# Altium schematic sheet main.SchDoc: Main
size Letter; SheetNumber: 2; SheetTotal: 2
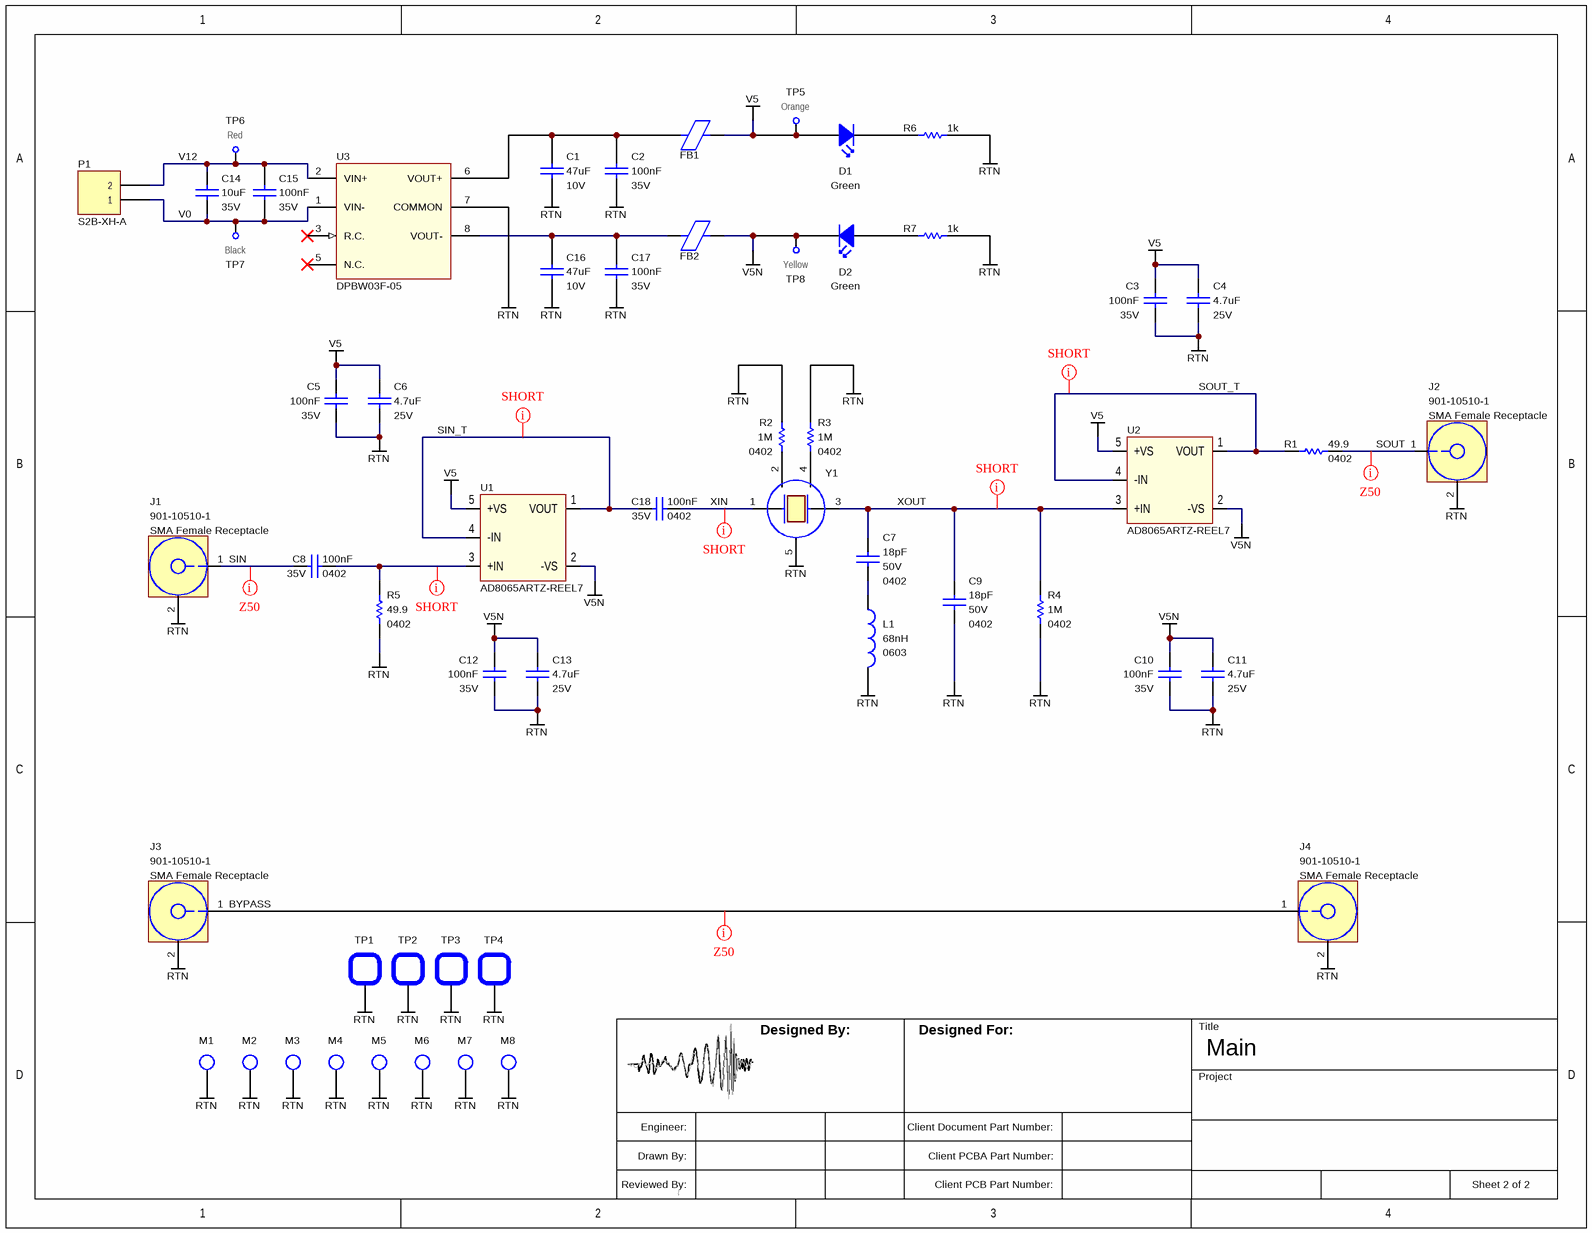
[diagram p0: main.SchDoc]

## Parts
C1  value 47uF  Voltage: 10V  [CAPC3225X25N]  (hidden comment: CGA6P1X7S1A476M250AC)
C2  value 100nF  Voltage: 35V  [CAPC1005X05N]  (hidden comment: CGA2B3X7R1V104K050BB)
C3  value 100nF  Voltage: 35V  [CAPC1005X05N]  (hidden comment: CGA2B3X7R1V104K050BB)
C4  value 4.7uF  Voltage: 25V  [CAPC2012X125N]  (hidden comment: CGA4J3X5R1E475K125AB)
C5  value 100nF  Voltage: 35V  [CAPC1005X05N]  (hidden comment: CGA2B3X7R1V104K050BB)
C6  value 4.7uF  Voltage: 25V  [CAPC2012X125N]  (hidden comment: CGA4J3X5R1E475K125AB)
C7  value 18pF  Voltage: 50V  Package: 0402  [CAPC1005X05N]  (hidden comment: CGA2B2C0G1H180J050BA)
C8  value 100nF  Voltage: 35V  Package: 0402  [CAPC1005X05N]  (hidden comment: CGA2B3X7R1V104K050BB)
C9  value 18pF  Voltage: 50V  Package: 0402  [CAPC1005X05N]  (hidden comment: CGA2B2C0G1H180J050BA)
C10  value 100nF  Voltage: 35V  [CAPC1005X05N]  (hidden comment: CGA2B3X7R1V104K050BB)
C11  value 4.7uF  Voltage: 25V  [CAPC2012X125N]  (hidden comment: CGA4J3X5R1E475K125AB)
C12  value 100nF  Voltage: 35V  [CAPC1005X05N]  (hidden comment: CGA2B3X7R1V104K050BB)
C13  value 4.7uF  Voltage: 25V  [CAPC2012X125N]  (hidden comment: CGA4J3X5R1E475K125AB)
C14  value 10uF  Voltage: 35V  [CAPC3216X16N]  (hidden comment: CGA5L3X5R1V106M160AB)
C15  value 100nF  Voltage: 35V  [CAPC1005X05N]  (hidden comment: CGA2B3X7R1V104K050BB)
C16  value 47uF  Voltage: 10V  [CAPC3225X25N]  (hidden comment: CGA6P1X7S1A476M250AC)
C17  value 100nF  Voltage: 35V  [CAPC1005X05N]  (hidden comment: CGA2B3X7R1V104K050BB)
C18  value 100nF  Voltage: 35V  Package: 0402  [CAPC1005X05N]  (hidden comment: CGA2B3X7R1V104K050BB)
D1  Color: Green  [0603_LED]  (hidden comment: LTST-C191KGKT)
D2  Color: Green  [0603_LED]  (hidden comment: LTST-C191KGKT)
FB1  BLM18AG102SN1  [INDC1608X08N]  (value not drawn)
FB2  BLM18AG102SN1  [INDC1608X08N]  (value not drawn)
J1  Notes: SMA Female Receptacle  [901-10510-1]
J2  Notes: SMA Female Receptacle  [901-10510-1]
J3  Notes: SMA Female Receptacle  [901-10510-1]
J4  Notes: SMA Female Receptacle  [901-10510-1]
L1  value 68nH  Package: 0603  [INDC1608X08N]  (hidden comment: LQW18AN68NJ00D)
M1  MOUNTM3  [MOUNTM3]  (value not drawn)  (no BOM)
M2  MOUNTM3  [MOUNTM3]  (value not drawn)  (no BOM)
M3  MOUNTM3  [MOUNTM3]  (value not drawn)  (no BOM)
M4  MOUNTM3  [MOUNTM3]  (value not drawn)  (no BOM)
M5  MOUNTM3  [MOUNTM3]  (value not drawn)  (no BOM)
M6  MOUNTM3  [MOUNTM3]  (value not drawn)  (no BOM)
M7  MOUNTM3  [MOUNTM3]  (value not drawn)  (no BOM)
M8  MOUNTM3  [MOUNTM3]  (value not drawn)  (no BOM)
P1  S2B-XH-A  [S2B-XH-A]
R1  value 49.9  Package: 0402  [RESC1005X035N]  (hidden comment: ERJ-2RKF49R9X)
R2  value 1M  Package: 0402  [RESC1005X035N]  (hidden comment: ERJ-2RKF1004X)
R3  value 1M  Package: 0402  [RESC1005X035N]  (hidden comment: ERJ-2RKF1004X)
R4  value 1M  Package: 0402  [RESC1005X035N]  (hidden comment: ERJ-2RKF1004X)
R5  value 49.9  Package: 0402  [RESC1005X035N]  (hidden comment: ERJ-2RKF49R9X)
R6  value 1k  [RESC1005X035N]  (hidden comment: ERJ-2RKF1001X)
R7  value 1k  [RESC1005X035N]  (hidden comment: ERJ-2RKF1001X)
TP1  5015  [5015]  (value not drawn)
TP2  5015  [5015]  (value not drawn)
TP3  5015  [5015]  (value not drawn)
TP4  5015  [5015]  (value not drawn)
TP5  Notes: Orange  [5003]
TP6  Notes: Red  [5000]
TP7  Notes: Black  [5001]
TP8  Notes: Yellow  [5004]
U1  AD8065ARTZ-REEL7  [SOT23-5]
U2  AD8065ARTZ-REEL7  [SOT23-5]
U3  DPBW03F-05  [SPBW03F-05_MWU]
Y1  311205346  [311205346]  (value not drawn)

## Nets
RTN: C1.1 C2.2 C3.2 C4.1 C5.2 C6.1 C9.1 C10.2 C11.1 C12.2 C13.1 C16.1 C17.2 J1.2(GND) J2.2(GND) J3.2(GND) J4.2(GND) L1.2 M1.1 M2.1 M3.1 M4.1 M5.1 M6.1 M7.1 M8.1 R2.2 R3.2 R4.1 R5.1 R6.2 R7.2 TP1.1 TP2.1 TP3.1 TP4.1 U3.7(COMMON) Y1.5
V5: C3.1 C4.2 C5.1 C6.2 D1.1(A) FB1.2 TP5.1 U1.5(+VS) U2.5(+VS)
V5N: C10.1 C11.2 C12.1 C13.2 D2.2(K) FB2.2 TP8.1 U1.2(-VS) U2.2(-VS)
BYPASS: J3.1(CENTER) J4.1(CENTER)
SIN: C8.2 J1.1(CENTER)
SIN_T: C18.2 U1.1(VOUT) U1.4(-IN)
SOUT: J2.1(CENTER) R1.1
SOUT_T: R1.2 U2.1(VOUT) U2.4(-IN)
V0: C14.1 C15.2 P1.1 TP7.1 U3.1(VIN-)
V12: C14.2 C15.1 P1.2 TP6.1 U3.2(VIN+)
XIN: C18.1 Y1.1
XOUT: C7.2 C9.2 R4.2 U2.3(+IN) Y1.3
NetC1_2: C1.2 C2.1 FB1.1 U3.6(VOUT+)
NetC7_1: C7.1 L1.1
NetC8_1: C8.1 R5.2 U1.3(+IN)
NetC16_2: C16.2 C17.1 FB2.1 U3.8(VOUT-)
NetD1_2: D1.2(K) R6.1
NetD2_1: D2.1(A) R7.1
NetR2_1: R2.1 Y1.2
NetR3_1: R3.1 Y1.4

Not connected (* = marked no-connect by the designer): U3 3(R.C.)* 5(N.C.)*

## Layout directives
net class Z50: BYPASS, SIN, SOUT
net class SHORT: NetC8_1, SIN_T, SOUT_T, XIN, XOUT

## Notes on the sheet
- Designed By:
- Designed For:
- Title
- Project
- Engineer:
- Drawn By:
- Reviewed By:
- Client Document Part Number:
- Client PCB Part Number:
- Client PCBA Part Number:

## Library data of the parts
C1 C16 = CGA6P1X7S1A476M250AC: CAPACITOR CERAMIC 47UF 20% 10V X7S 1210; Tcr: +/-22%; MFG: TDK; Tr: –55:125; Qual: AEC-Q200; Tolerance: 20%; MPN: CGA6P1X7S1A476M250AC; Power: *
C2 C3 C5 C8 C10 C12 C15 C17 C18 = CGA2B3X7R1V104K050BB: CAPACITOR CERAMIC 100NF 10% 35V X7R 0402; Tcr: +/-15%; MFG: TDK; Tr: –55:125; Qual: AEC-Q200; Tolerance: 10%; MPN: CGA2B3X7R1V104K050BB; Power: *
  C2 C3 C5 C10 C12 C15 C17: Package: 0402
C4 C6 C11 C13 = CGA4J3X5R1E475K125AB: CAPACITOR CERAMIC 4.7UF 10% 25V X5R 0805; Tcr: +/-15%; MFG: TDK; Tr: –55:85; Qual: AEC-Q200; Tolerance: 10%; MPN: CGA4J3X5R1E475K125AB; Power: *
C7 C9 = CGA2B2C0G1H180J050BA: CAPACITOR CERAMIC 18PF 5% 50V C0G 0402; Tcr: +/-30; MFG: TDK; Tr: –55:125; Qual: AEC-Q200; Tolerance: 5%; MPN: CGA2B2C0G1H180J050BA; Power: *
C14 = CGA5L3X5R1V106M160AB: CAPACITOR CERAMIC 10UF 20% 35V X5R 1206; Tcr: +/-15%; MFG: TDK; Tr: –55:85; Qual: AEC-Q200; Tolerance: 20%; MPN: CGA5L3X5R1V106M160AB; Power: *
D1 D2 = LTST-C191KGKT: LED GREEN CLEAR SMD; MFG: LITE-ON INC; MPN: LTST-C191KGKT
FB1 FB2 = BLM18AG102SN1: FERRITE BEAD 1000-OHM 450MA 0603; MFG: MURATA; DCR: 0.5; Tr: -55:125; Imedance: 1000-OHM @ 100MHz; MPN: BLM18AG102SN1; Current: 450mA
J1-J4 = 901-10510-1: SMA BOARD EDGE CONNECTOR FEMALE; MFG: AMPHENOL; MPN: 901-10510-1
L1 = LQW18AN68NJ00D: FIXED IND 68NH 340MA 0.38OHM SMD; MFG: MURATA; MPN: LQW18AN68NJ00D
M1-M8 = MOUNTM3: M3 MOUNTING HOLE
P1 = S2B-XH-A: CONN HEADER R/A 2POS 2.5MM; MFG: JST; MPN: S2B-XH-A
R1 R5 = ERJ-2RKF49R9X: RESISTOR THICK FILM 49.9 OHM 1% 0402; Tcr: +/-100; MFG: PANASONIC; Tr: -55:155; Voltage: 50V; Qual: AEC-Q200 GRADE 0; Tolerance: 1%; MPN: ERJ-2RKF49R9X; Power: *
R2-R4 = ERJ-2RKF1004X: RESISTOR THICK FILM 1M OHM 1% 0402; Tcr: +/-100; MFG: PANASONIC; Tr: -55:155; Voltage: 50V; Qual: AEC-Q200 GRADE 0; Tolerance: 1%; MPN: ERJ-2RKF1004X; Power: *
R6 R7 = ERJ-2RKF1001X: RESISTOR THICK FILM 1k OHM 1% 0402; Tcr: +/-100; MFG: PANASONIC; Tr: -55:155; Voltage: 50V; Qual: AEC-Q200 GRADE 0; Tolerance: 1%; MPN: ERJ-2RKF1001X; Power: *
TP1-TP4 = 5015: TEST POINT SMD; MFG: KEYSTONE; MPN: 5015
TP5 = 5003: THRUHOLE MOUNT TEST POINT, 4.6MM TALL, ORANGE; MFG: KEYSTONE; MPN: 5003; Do Not Place: *
TP6 = 5000: THRUHOLE MOUNT TEST POINT, 4.6MM TALL, RED; MFG: KEYSTONE; MPN: 5000; Do Not Place: *
TP7 = 5001: THRUHOLE MOUNT TEST POINT, 4.6MM TALL, BLACK; MFG: KEYSTONE; MPN: 5001; Do Not Place: *
TP8 = 5004: THRUHOLE MOUNT TEST POINT, 4.6MM TALL, YELLOW; MFG: KEYSTONE; MPN: 5004; Do Not Place: *
U1 U2 = AD8065ARTZ-REEL7: IC OPAMP VFB 1 CIRCUIT SOT23-5; MFG: ANALOG DEVICES; MPN: AD8065ARTZ-REEL7
U3 = SPBW03F-05: DC DC CONVERTER +/-5V 3W; MFG: MEAN WELL; MPN: DPBW03F-05
Y1 = 311205346: CUSTOM CRYSTAL RESONATOR; MFG: VECTRON; MPN: 311205346